# EAGLE design Qt_Py_j-link (EAGLE 9.6.2)
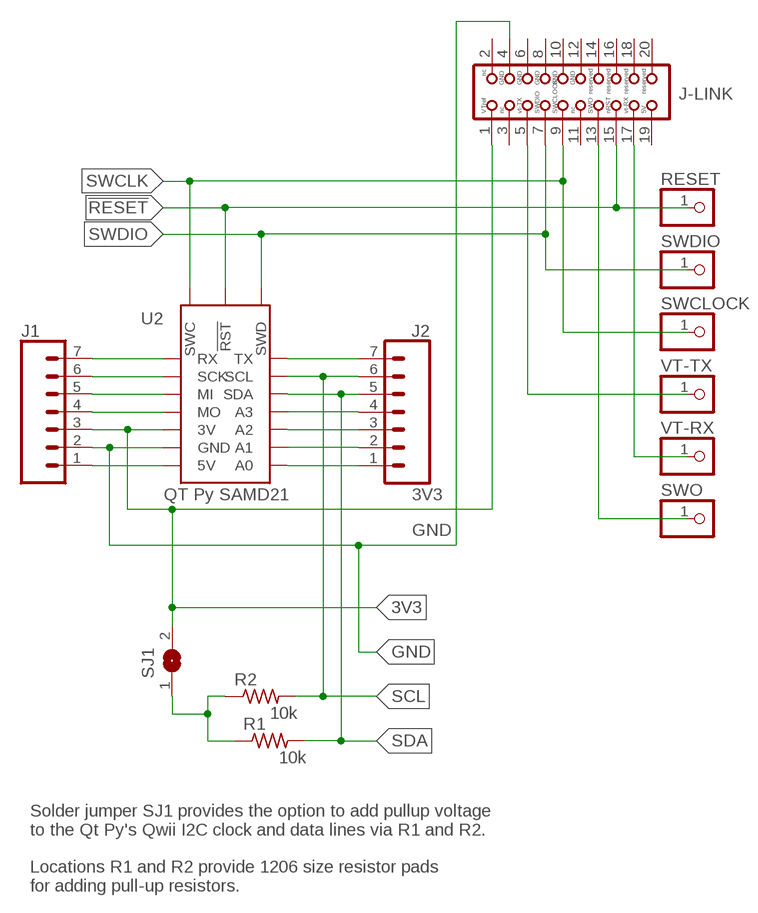
[diagram p0: schematic, sheet 1]

## Parts
J1  CONN_07  [1X07]
J2  CONN_07  [1X07]
J-LINK  JLINK-ARM  [JTAG-ARM]
R1  10k  R-US_M1206  [M1206]
R2  10k  R-US_M1206  [M1206]
RESET  PINHD-1X1  [1X01]
SJ1  SJ-OPEN  [SJ]
SWCLOCK  PINHD-1X1  [1X01]
SWDIO  PINHD-1X1  [1X01]
SWO  PINHD-1X1  [1X01]
U2  QT Py SAMD21  QT_PY-SWD-TH  [QT_PY-SWD-TH]
VT-RX  PINHD-1X1  [1X01]
VT-TX  PINHD-1X1  [1X01]

## Nets
3V3 [I2C]: J1.3 J-LINK.1 SJ1.2 U2.3V3@1(3V) U2.3V3@2(3V)
5V [I2C]: J1.1 U2.5V@1(5V) U2.5V@2(5V)
!RESET: J-LINK.15 RESET.1 U2.!RESET(!RST)
A0: J2.1 U2.A0@1(A0) U2.A0@2(A0)
GND [I2C]: J1.2 J-LINK.4 U2.GND@1(GND) U2.GND@2(GND)
N$1: J1.7 U2.RX@1(RX) U2.RX@2(RX)
N$2: J1.6 U2.SCLK@1(SCK) U2.SCLK@2(SCK)
N$3: J1.5 U2.MISO@1(MI) U2.MISO@2(MI)
N$4: J1.4 U2.MOSI@1(MO) U2.MOSI@2(MO)
N$5: J2.4 U2.A3@1(A3) U2.A3@2(A3)
N$6: J2.2 U2.A1@1(A1) U2.A1@2(A1)
N$8: J2.3 U2.A2@1(A2) U2.A2@2(A2)
N$14: J2.7 U2.TX@1(TX) U2.TX@2(TX)
PULL-UP: R1.1 R2.1 SJ1.1
SCL: J2.6 R2.2 U2.SCL@1(SCL) U2.SCL@2(SCL)
SDA: J2.5 R1.2 U2.SDA@1(SDA) U2.SDA@2(SDA)
SWCLK: J-LINK.9 SWCLOCK.1 U2.SWCLK(SWC)
SWDIO: J-LINK.7 SWDIO.1 U2.SWDIO(SWD)
SWO: J-LINK.13 SWO.1
VT-RX: J-LINK.17 VT-RX.1
VT-TX: J-LINK.5 VT-TX.1
Unconnected: J-LINK.2 J-LINK.3 J-LINK.6 J-LINK.8 J-LINK.10 J-LINK.11 J-LINK.12 J-LINK.14 J-LINK.16 J-LINK.18 J-LINK.19 J-LINK.20

## Notes on the sheet
- Solder jumper SJ1 provides the option to add pullup voltage
  to the Qt Py's Qwii I2C clock and data lines via R1 and R2.
  
  Locations R1 and R2 provide 1206 size resistor pads
  for adding pull-up resistors.

## Library data of the parts
J1 J2 = SparkFun-Connectors:CONN_07: Multi connection point. Often used as Generic Header-pin footprint for 0.1 inch spaced/style header connections On any of the 0.1 inch spaced packages, you can populate with these: Break Away Headers - Straight <https://www.sparkfun.com/products/116> (PRT-00116) Break Away Male Headers - Right Angle <https://www.sparkfun.com/products/553> (PRT-00553) Female Headers <https://www.sparkfun.com/products/115> (PRT-00115) Break Away Headers - Machine Pin <https://www.sparkfun.com/products/117> (PRT-00117) Break Away Female Headers - Swiss Machine Pin <https://www.sparkfun.com/products/743> (PRT-00743) For SCREWTERMINALS and SPRING TERMINALS visit here: Screw Terimnals on SparkFun.com <https://www.sparkfun.com/search/results?term=Screw+Terminals> (5mm/3.5mm/2.54mm spacing) This device is also useful as a general connection point to wire up your design to another part of your project. Our various solder wires solder well into these plated through hole pads. Hook-Up Wire - Assortment (Stranded, 22 AWG) <https://www.sparkfun.com/products/11375> (PRT-11375) Hook-Up Wire - Assortment (Solid Core, 22 AWG) <https://www.sparkfun.com/products/11367> (PRT-11367) View the entire wire category on our website here <https://www.sparkfun.com/categories/141> Special notes: Molex polarized connector foot print use with SKU : PRT-08231 with associated crimp pins and housings. 1MM SMD Version SKU: PRT-10208 NOTES ON THE VARIANTS LOCK and LOCK_LONGPADS... This footprint was designed to help hold the alignment of a through-hole component (i.e. 6-pin header) while soldering it into place. You may notice that each hole has been shifted either up or down by 0.005 of an inch from it's more standard position (which is a perfectly straight line). This slight alteration caused the pins (the squares in the middle) to touch the edges of the holes. Because they are alternating, it causes a "brace" to hold the component in place. 0.005 has proven to be the perfect amount of "off-center" position when using our standard breakaway headers. Although looks a little odd when you look at the bare footprint, once you have a header in there, the alteration is very hard to notice. Also,if you push a header all the way into place, it is covered up entirely on the bottom side.
J-LINK = home:JLINK-ARM: 20 Pin JTAG Connector For use with ARM7, and ARM9. Supported by some Cortex M3 boards with SWJ-DP interfaces (dual SWP/JTAG support). 4UConnector: 03556
R1 R2 = adafruit:R-US_: RESISTOR, American symbol
RESET SWCLOCK SWDIO SWO VT-RX VT-TX = adafruit:PINHD-1X1: Pin header 1x1 for 0.1" spacing With round pins
SJ1 = connectors_gen:SJ-OPEN: SMD solder JUMPER
U2 = home:QT_PY-SWD

## Net classes
0 default: width 0.203 mm, clearance 0.203 mm
1 I2C: width 0.305 mm, clearance 0.254 mm

## Board
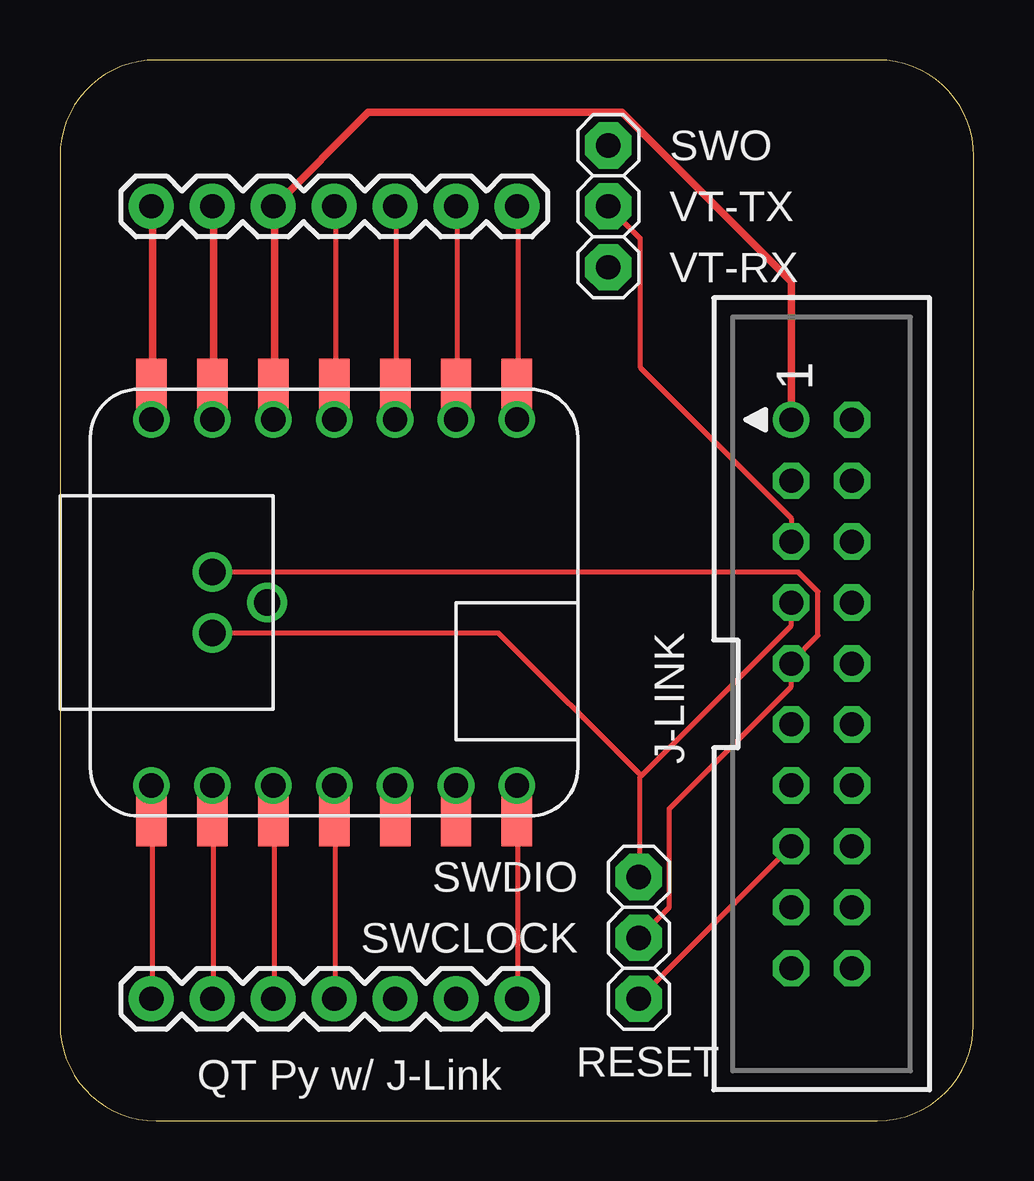
[diagram p1: board, top side]
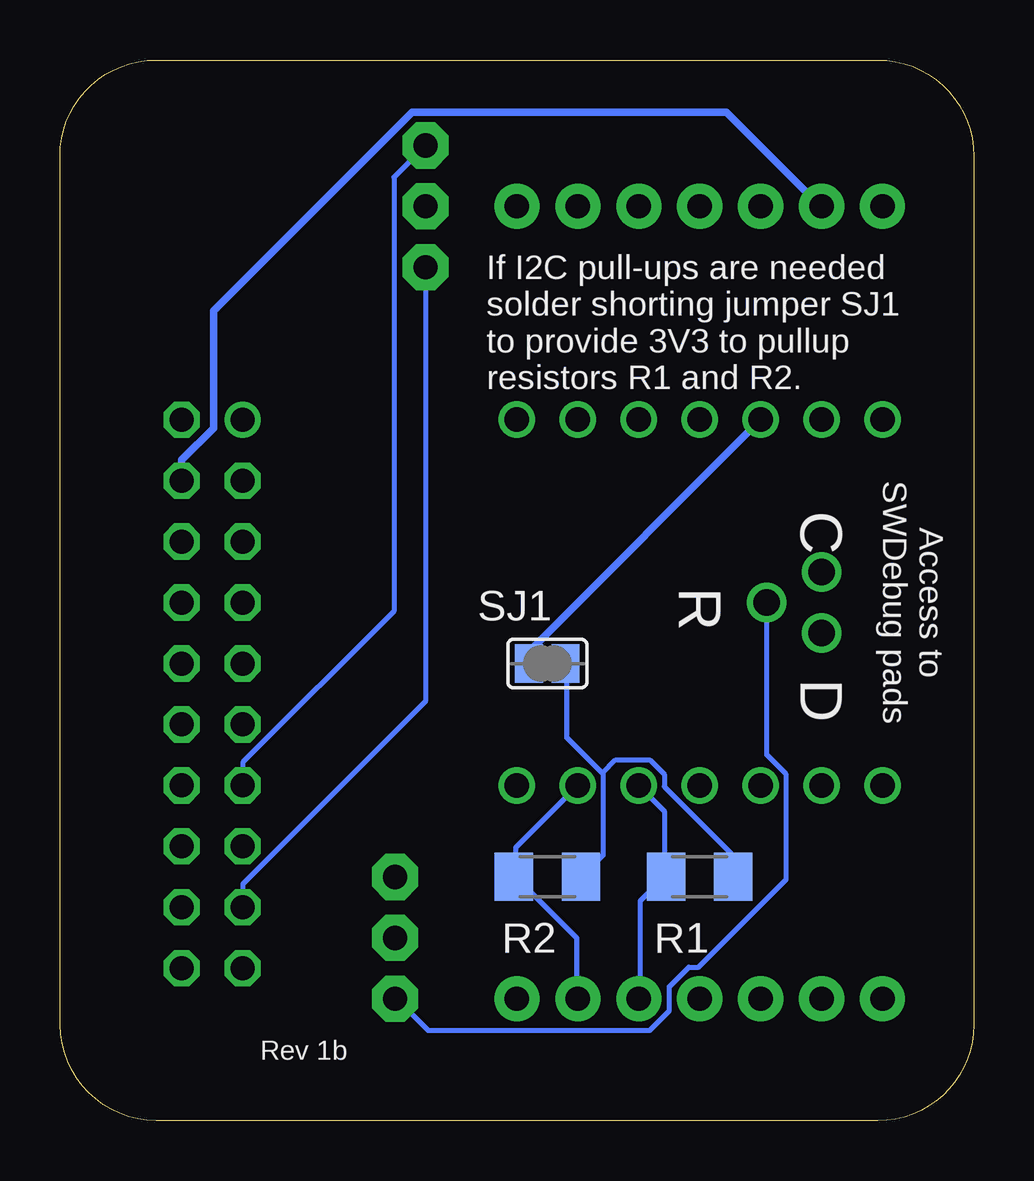
[diagram p2: board, bottom side, seen from below]

Size 38.1 x 44.2 mm. Coordinates in mm from the lower left corner, seen from the top.
Outline: 0,40.2 0,4 arc90 4,0 34.08,0 arc90 38.08,4 38.1,40.19 arc90 34.1,44.2 4,44.2 arc90 0,40.2
Copper layers (1*16): Top 0.035mm / dielectric 1.5mm / Bottom 0.035mm
Design rules "default": minimum track width 6mil, minimum drill 0.35mm, track to track 6mil, track to pad 6mil, pad to pad 6mil, via to via 6mil, smd to smd 6mil, copper to edge 40mil, drill to drill 6mil, minimum pad ring 10mil, minimum via ring 8mil, stop-mask expansion 4mil, vias tented up to drill 0mil, thermal gap 10mil

### Footprints (pad centres in the part's own frame; a part is rotated, then mirrored left to right if it is on the bottom)
1X07 = drill 1.016 pad 1.88: 1 0,0; 2 2.54,0; 3 5.08,0; 4 7.62,0; 5 10.16,0; 6 12.7,0; 7 15.24,0
JTAG-ARM = drill 1: 1 -11.43,-1.27 | drill 1 octagon: 2 -11.43,1.27; 3 -8.89,-1.27; 4 -8.89,1.27; 5 -6.35,-1.27; 6 -6.35,1.27; 7 -3.81,-1.27; 8 -3.81,1.27; 9 -1.27,-1.27; 10 -1.27,1.27; 11 1.27,-1.27; 12 1.27,1.27; 13 3.81,-1.27; 14 3.81,1.27; 15 6.35,-1.27; 16 6.35,1.27; 17 8.89,-1.27; 18 8.89,1.27; 19 11.43,-1.27; 20 11.43,1.27
M1206 = smd 1.6 x 2: 1 -1.4,0; 2 1.4,0
1X01 = drill 1.016 pad 1.93 octagon: 1 0,0
SJ = smd 1.168 x 1.6: 1 -0.762,0; 2 0.762,0
QT_PY-SWD-TH = drill 1.016: 3V3@1 7.62,2.54; 5V@1 7.62,7.62; A0@1 -7.62,7.62; A1@1 -7.62,5.08; A2@1 -7.62,2.54; A3@1 -7.62,0; GND@1 7.62,5.08; MISO@1 7.62,-2.54; MOSI@1 7.62,0; RX@1 7.62,-7.62; SCL@1 -7.62,-5.08; SCLK@1 7.62,-5.08; SDA@1 -7.62,-2.54; TX@1 -7.62,-7.62 | smd 2.54 x 1.27: 3V3@2 8.89,2.54; 5V@2 8.89,7.62; A0@2 -8.89,7.62; A1@2 -8.89,5.08; A2@2 -8.89,2.54; A3@2 -8.89,0; GND@2 8.89,5.08; MISO@2 8.89,-2.54; MOSI@2 8.89,0; RX@2 8.89,-7.62; SCL@2 -8.89,-5.08; SCLK@2 8.89,-5.08; SDA@2 -8.89,-2.54; TX@2 -8.89,-7.62 | drill 1.1: !RESET 0,2.794; SWCLK 1.27,5.08; SWDIO -1.27,5.08

### Placement (x,y rotation side)
J1  3.81,38.1 0 top
J2  3.81,5.08 0 top
J-LINK  31.75,17.78 270 top
R1  11.43,10.16 180 bottom
R2  17.78,10.16 180 bottom
RESET  24.13,5.08 0 top
SJ1  17.78,19.05 180 bottom
SWCLOCK  24.13,7.62 0 top
SWDIO  24.13,10.16 0 top
SWO  22.86,40.64 0 top
U2  11.43,21.59 90 top
VT-RX  22.86,35.56 0 top
VT-TX  22.86,38.1 0 top

### Tracks (layer width: path | path; a pad name or v marks a point on that pad's centre or on a via)
3V3
  Top 0.305: U2.3V3@1 8.94,29.26 8.94,30.48 U2.3V3@2 8.94,30.58 8.94,38 J1.3 8.94,38.1 12.85,42.01 23.43,42.01 30.48,34.96 J-LINK.1
  Bottom 0.305: U2.3V3@1 18.49,19.61 18.49,19.1 SJ1.2
5V
  Top 0.305: U2.5V@1 3.86,29.26 3.86,30.48 U2.5V@2 3.86,30.58 3.86,38.1 J1.1
!RESET
  Top 0.203: RESET.1 J-LINK.15
  Bottom 0.203: U2.!RESET 8.64,15.24 7.82,14.43 7.82,10.06 11.48,6.4 11.89,6.4 12.7,5.59 12.7,4.57 13.51,3.76 22.76,3.76 24.08,5.08 RESET.1
A0
  Top 0.203: 3.86,12.7 3.86,13.92 U2.A0@1 | 3.86,12.7 3.86,5.08 J2.1 | 3.86,12.7 U2.A0@2
GND
  Top 0.305: U2.GND@1 6.4,29.26 6.4,30.48 U2.GND@2 6.4,30.58 6.4,38.1 J1.2
  Bottom 0.305: J-LINK.4 33.02,27.53 31.7,28.85 31.7,33.74 23.43,42.01 10.31,42.01 6.4,38.1 J1.2
N$1
  Top 0.203: 19.1,30.48 19.1,29.26 U2.RX@1 | 19.1,30.48 19.1,38.1 J1.7 | 19.1,30.48 U2.RX@2
N$2
  Top 0.203: 16.56,30.48 16.56,29.26 U2.SCLK@1 | 16.56,30.48 16.56,38.1 J1.6 | 16.56,30.48 U2.SCLK@2
N$3
  Top 0.203: 14.02,30.48 14.02,29.26 U2.MISO@1 | 14.02,30.48 14.02,38.1 J1.5 | 14.02,30.48 U2.MISO@2
N$4
  Top 0.203: 11.48,30.48 11.48,29.26 U2.MOSI@1 | 11.48,30.48 11.48,38.1 J1.4 | 11.48,30.48 U2.MOSI@2
N$5
  Top 0.203: 11.48,12.7 11.48,13.92 U2.A3@1 | 11.48,12.7 11.48,5.08 J2.4 | 11.48,12.7 U2.A3@2
N$6
  Top 0.203: 6.4,12.7 6.4,13.92 U2.A1@1 | 6.4,12.7 6.4,5.08 J2.2 | 6.4,12.7 U2.A1@2
N$8
  Top 0.203: 8.94,12.7 8.94,13.92 U2.A2@1 | 8.94,12.7 8.94,5.08 J2.3 | 8.94,12.7 U2.A2@2
N$14
  Top 0.203: 19.1,12.7 19.1,13.92 U2.TX@1 | 19.1,12.7 19.1,5.08 J2.7 | 19.1,12.7 U2.TX@2
PULL-UP
  Bottom 0.203: 15.49,14.48 15.44,14.43 15.44,11.07 16.36,10.16 R2.1 | 15.49,14.48 16.97,15.95 16.97,19 SJ1.1 | 15.49,14.48 14.94,15.04 13.51,15.04 12.9,14.43 12.9,13.92 10.06,11.07 10.06,10.16 R1.1
SCL
  Top 0.203: U2.SCL@2 16.56,12.7 16.56,13.92 U2.SCL@1
  Bottom 0.203: 19.1,10.16 19.1,11.38 U2.SCL@1 | 19.1,10.16 16.56,7.62 16.56,5.08 J2.6 | 19.1,10.16 R2.2
SDA
  Top 0.203: U2.SDA@2 14.02,12.7 14.02,13.92 U2.SDA@1
  Bottom 0.203: 12.9,10.16 12.9,12.9 U2.SDA@1 | 12.9,10.16 13.92,9.14 13.92,5.08 J2.5 | 12.9,10.16 R1.2
SWCLK
  Top 0.203: U2.SWCLK 30.79,22.86 31.6,22.05 31.6,20.22 30.48,19.1 J-LINK.9 30.48,18.09 25.4,13.01 25.4,8.89 SWCLOCK.1
SWDIO
  Top 0.203: J-LINK.7 30.48,20.62 24.23,14.38 | 24.23,14.38 24.18,14.33 24.18,10.16 SWDIO.1 | U2.SWDIO 18.29,20.32 24.23,14.38
SWO
  Bottom 0.203: J-LINK.13 30.48,14.94 24.18,21.23 24.18,39.32 SWO.1
VT-RX
  Bottom 0.203: J-LINK.17 30.48,9.86 22.86,17.48 VT-RX.1
VT-TX
  Top 0.203: J-LINK.5 30.48,25.09 24.18,31.39 24.18,36.78 VT-TX.1

### Text on the board
tPlace: QT Py w/ J-Link
bPlace: If I2C pull-ups are needed / solder shorting jumper SJ1 / to provide 3V3 to pullup / resistors R1 and R2. | C | Access to / SWDebug pads | R | D | Rev 1b